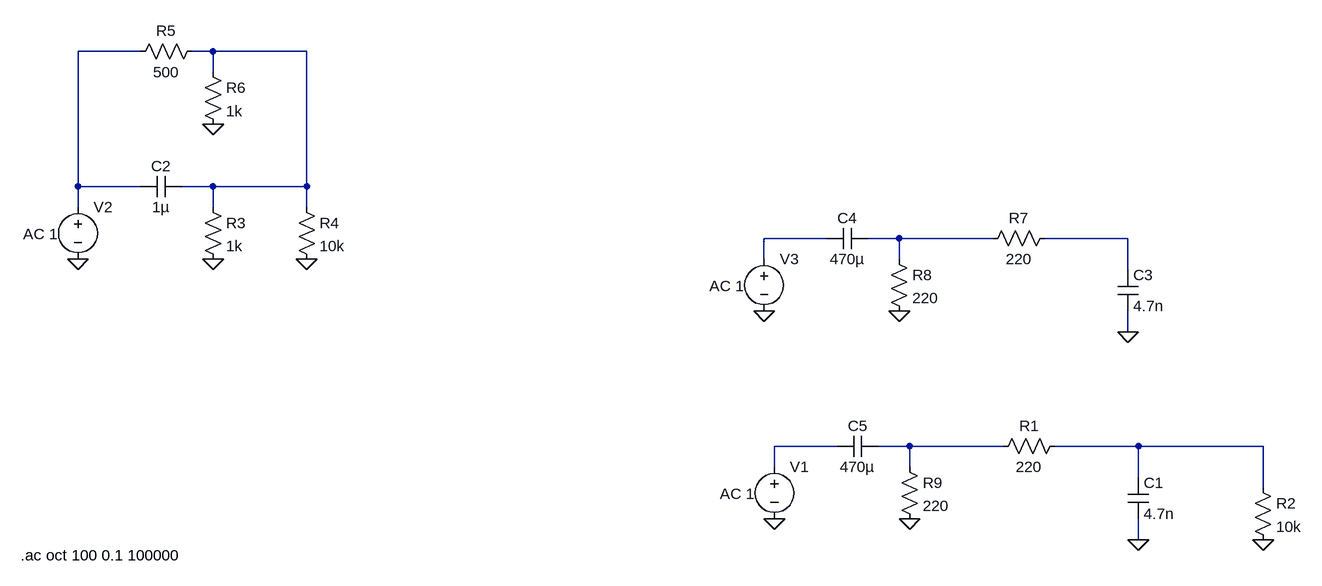
[diagram p0: schematic bandpass,lowshelf.asc]
bandpass,lowshelf.asc, the LTspice schematic file:
Version 4
SHEET 1 1664 744
WIRE -608 -592 -704 -592
WIRE -496 -592 -528 -592
WIRE -352 -592 -496 -592
WIRE -496 -560 -496 -592
WIRE -704 -384 -704 -592
WIRE -608 -384 -704 -384
WIRE -496 -384 -544 -384
WIRE -352 -384 -352 -592
WIRE -352 -384 -496 -384
WIRE -704 -352 -704 -384
WIRE -496 -352 -496 -384
WIRE -352 -352 -352 -384
WIRE 448 -304 352 -304
WIRE 560 -304 512 -304
WIRE 704 -304 560 -304
WIRE 912 -304 784 -304
WIRE 352 -272 352 -304
WIRE 560 -272 560 -304
WIRE 912 -256 912 -304
WIRE 912 -160 912 -192
WIRE 464 16 368 16
WIRE 576 16 528 16
WIRE 720 16 576 16
WIRE 928 16 800 16
WIRE 1120 16 928 16
WIRE 368 48 368 16
WIRE 576 48 576 16
WIRE 928 64 928 16
WIRE 1120 80 1120 16
WIRE 928 160 928 128
FLAG 1120 160 0
FLAG -704 -272 0
FLAG -496 -272 0
FLAG -352 -272 0
FLAG -496 -480 0
FLAG 912 -160 0
FLAG 352 -192 0
FLAG 560 -192 0
FLAG 928 160 0
FLAG 368 128 0
FLAG 576 128 0
SYMBOL res 1104 64 R0
SYMATTR InstName R2
SYMATTR Value 10k
SYMBOL voltage -704 -368 R0
WINDOW 123 -84 57 Left 2
WINDOW 39 0 0 Left 0
SYMATTR Value2 AC 1
SYMATTR InstName V2
SYMATTR Value ""
SYMBOL cap -544 -400 R90
WINDOW 0 0 32 VBottom 2
WINDOW 3 32 32 VTop 2
SYMATTR InstName C2
SYMATTR Value 1µ
SYMBOL res -512 -368 R0
SYMATTR InstName R3
SYMATTR Value 1k
SYMBOL res -368 -368 R0
SYMATTR InstName R4
SYMATTR Value 10k
SYMBOL res -512 -608 R90
WINDOW 0 0 56 VBottom 2
WINDOW 3 32 56 VTop 2
SYMATTR InstName R5
SYMATTR Value 500
SYMBOL res -512 -576 R0
SYMATTR InstName R6
SYMATTR Value 1k
SYMBOL cap 896 -256 R0
SYMATTR InstName C3
SYMATTR Value 4.7n
SYMBOL res 800 -320 R90
WINDOW 0 0 56 VBottom 2
WINDOW 3 32 56 VTop 2
SYMATTR InstName R7
SYMATTR Value 220
SYMBOL voltage 352 -288 R0
WINDOW 123 -84 57 Left 2
WINDOW 39 0 0 Left 0
SYMATTR Value2 AC 1
SYMATTR InstName V3
SYMATTR Value ""
SYMBOL cap 512 -320 R90
WINDOW 0 0 32 VBottom 2
WINDOW 3 32 32 VTop 2
SYMATTR InstName C4
SYMATTR Value 470µ
SYMBOL res 544 -288 R0
SYMATTR InstName R8
SYMATTR Value 220
SYMBOL cap 912 64 R0
SYMATTR InstName C1
SYMATTR Value 4.7n
SYMBOL res 816 0 R90
WINDOW 0 0 56 VBottom 2
WINDOW 3 32 56 VTop 2
SYMATTR InstName R1
SYMATTR Value 220
SYMBOL voltage 368 32 R0
WINDOW 123 -84 57 Left 2
WINDOW 39 0 0 Left 0
SYMATTR Value2 AC 1
SYMATTR InstName V1
SYMATTR Value ""
SYMBOL cap 528 0 R90
WINDOW 0 0 32 VBottom 2
WINDOW 3 32 32 VTop 2
SYMATTR InstName C5
SYMATTR Value 470µ
SYMBOL res 560 32 R0
SYMATTR InstName R9
SYMATTR Value 220
TEXT -792 184 Left 2 !.ac oct 100 0.1 100000

The netlist it stands for:
* bandpass,lowshelf.asc
R2 N008 0 10k
V2 N001 0 AC 1
C2 N002 N001 1µ
R3 N002 0 1k
R4 N002 0 10k
R5 N002 N001 500
R6 N002 0 1k
C3 N005 0 4.7n
R7 N005 N004 220
V3 N003 0 AC 1
C4 N004 N003 470µ
R8 N004 0 220
C1 N008 0 4.7n
R1 N008 N007 220
V1 N006 0 AC 1
C5 N007 N006 470µ
R9 N007 0 220
.ac oct 100 0.1 100000
.backanno
.end